# EAGLE design doodle with onboard clock smd 7805 (EAGLE 6.2)
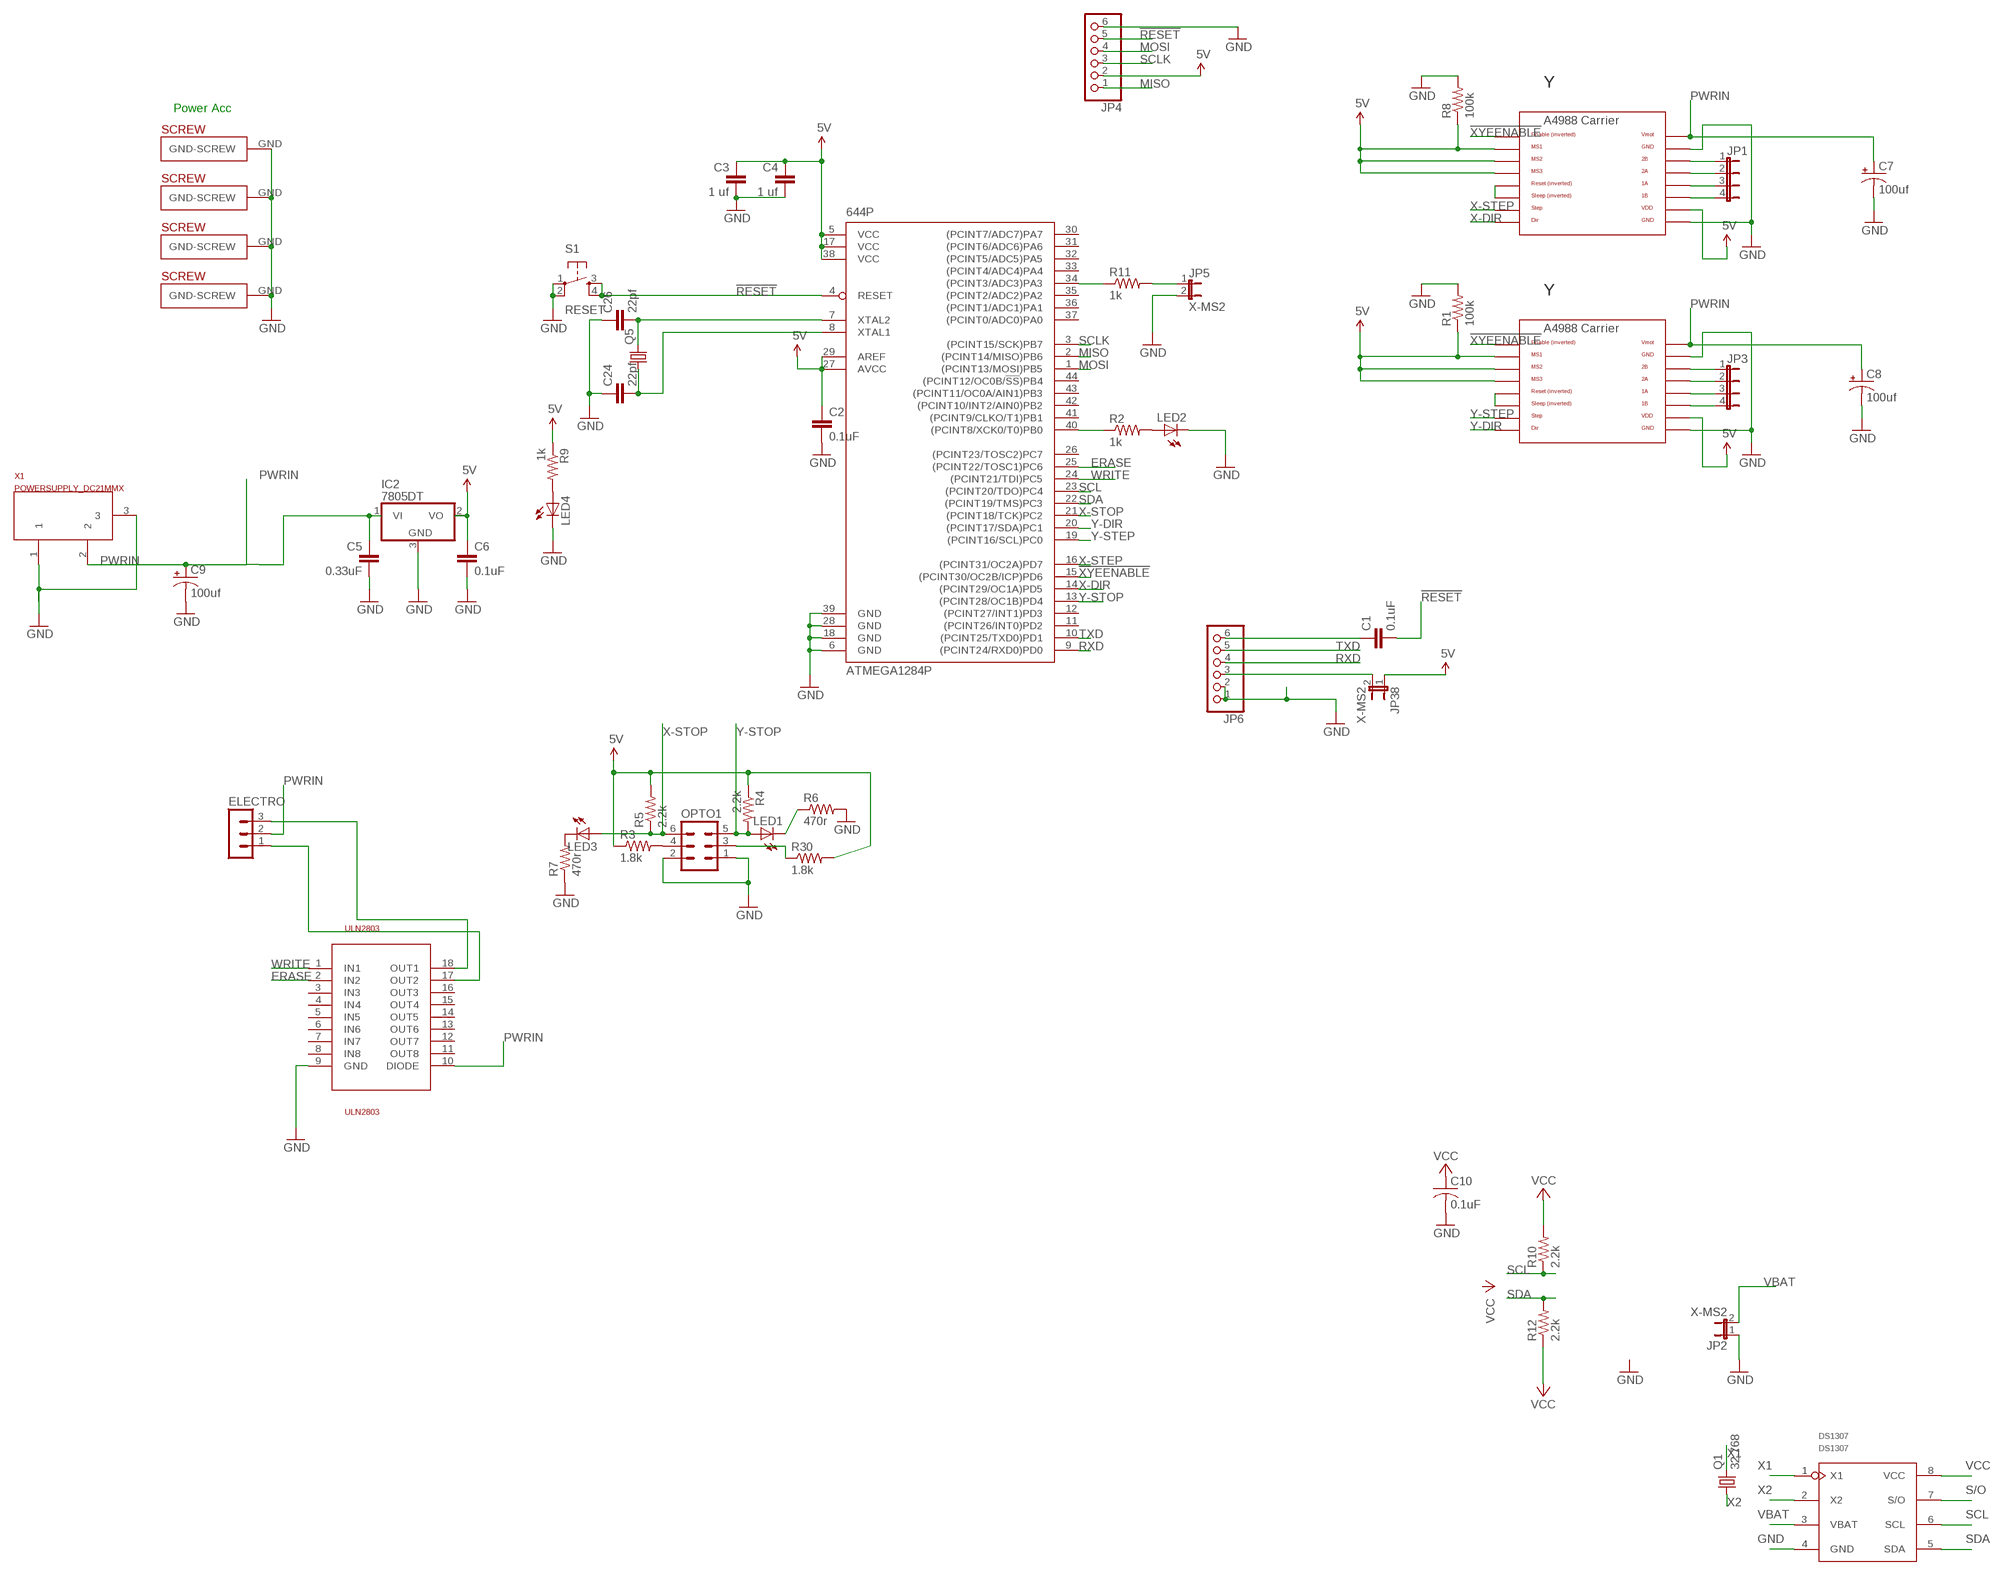
[diagram p0: schematic, sheet 1]

## Parts
644P  ATMEGA1284P  ATMEGA644A  [TQFP44]
C1  0.1uF  CAP0805  [0805]
C2  0.1uF  CAP0805  [0805]
C3  1 uf  CAP0805  [0805]
C4  1 uf  CAP0805  [0805]
C5  0.33uF  CAPPTH2  [CAP-PTH-SMALL2]
C6  0.1uF  CAPPTH2  [CAP-PTH-SMALL2]
C7  100uf  CAP_POLPTH1  [CPOL-RADIAL-100UF-25V]
C8  100uf  CAP_POLPTH1  [CPOL-RADIAL-100UF-25V]
C9  100uf  CAP_POLPTH1  [CPOL-RADIAL-100UF-25V]
C10  0.1uF  C-USC0805  [C0805]
C24  22pf  CAP0805  [0805]
C26  22pf  CAP0805  [0805]
DS1307  DS1307  [SO08]
ELECTRO  MA03-1  [MA03-1]
IC2  7805DT  [TO252]
JP1  JP4E  [JP4]
JP2  X-MS2  JUMPER-2PTH  [1X02]
JP3  JP4E  [JP4]
JP4  PINHD-1X6/90  [1X06/90]
JP5  X-MS2  JUMPER-2PTH  [1X02]
JP6  PINHD-1X6  [1X06]
JP38  X-MS2  JUMPER-2PTH  [1X02]
LED1  LEDCHIPLED_0805  [CHIPLED_0805]
LED2  LEDCHIPLED_0805  [CHIPLED_0805]
LED3  LEDCHIPLED_0805  [CHIPLED_0805]
LED4  LEDCHIPLED_0805  [CHIPLED_0805]
OPTO1  MA03-2  [MA03-2]
Q1  32.768  CRYTALTC38H  [TC38H]
Q5  CRYSTALHC49S  [HC49/S]
R1  100k  R-US_0207/7  [0207/7]
R2  1k  R-US_R0805  [R0805]
R3  1.8k  R-US_R0805  [R0805]
R4  2.2k  R-US_R0805  [R0805]
R5  2.2k  R-US_R0805  [R0805]
R6  470r  R-US_R0805  [R0805]
R7  470r  R-US_R0805  [R0805]
R8  100k  R-US_0207/7  [0207/7]
R9  1k  R-US_R0805  [R0805]
R10  2.2k  R-US_R0805  [R0805]
R11  1k  R-US_R0805  [R0805]
R12  2.2k  R-US_R0805  [R0805]
R30  1.8k  R-US_R0603  [R0603]
S1  RESET  TAC_SWITCHPTH  [TACTILE-PTH]
U$1  A4988BREAKOUT  [A4988BREAKOUT]
U$7  A4988BREAKOUT  [A4988BREAKOUT]
U$14  PLATED-SCREW  [PLATEDSCREW]
U$17  PLATED-SCREW  [PLATEDSCREW]
U$18  PLATED-SCREW  [PLATEDSCREW]
U$38  PLATED-SCREW  [PLATEDSCREW]
ULN2803  ULN2803  [SO18L]
X1  POWERSUPPLY_DC21MMX  [POWERSUPPLY_DC-21MM]

## Nets
5V: 644P.5(VCC) 644P.17(VCC) 644P.27(AVCC) 644P.29(AREF) 644P.38(VCC) C2.1 C3.1 C4.1 C6.1 IC2.2(VO) JP4.2 JP38.1 R1.1 R3.1 R4.1 R5.2 R8.1 R9.1 R30.2 U$1.MS1 U$1.MS2 U$1.MS3 U$1.VDD U$7.MS1 U$7.MS2 U$7.MS3 U$7.VDD
!RESET: 644P.4(RESET) C1.2 JP4.5 S1.3 S1.4
!XYEENABLE: 644P.15((PCINT30/OC2B/ICP)PD6) U$1.EN U$7.EN
ERASE: 644P.25((PCINT22/TOSC1)PC6) ULN2803.2(IN2)
GND: 644P.6(GND) 644P.18(GND) 644P.28(GND) 644P.39(GND) C2.2 C3.2 C4.2 C5.2 C6.2 C7.2(-) C8.2(-) C9.2(-) C10.2 C24.1 C26.1 DS1307.4(GND) IC2.3(GND) JP2.1 JP4.6 JP5.2 JP6.1 JP6.2 LED2.C LED4.C OPTO1.1 OPTO1.2 R1.2 R6.2 R7.1 R8.2 S1.1 S1.2 U$1.GND U$1.GND@0(GND) U$7.GND U$7.GND@0(GND) U$14.GND(GND-SCREW) U$17.GND(GND-SCREW) U$18.GND(GND-SCREW) U$38.GND(GND-SCREW) ULN2803.9(GND) X1.1 X1.3
MISO: 644P.2((PCINT14/MISO)PB6) JP4.1
MOSI: 644P.1((PCINT13/MOSI)PB5) JP4.4
N$1: U$1.RST U$1.SLP(SLEEP)
N$2: JP3.1 U$1.2B
N$3: JP3.2 U$1.2A
N$4: JP3.3 U$1.1A
N$5: JP3.4 U$1.1B
N$6: ELECTRO.1 ULN2803.17(OUT2)
N$7: ELECTRO.3 ULN2803.18(OUT1)
N$8: OPTO1.4 R3.2
N$9: LED2.A R2.2
N$10: 644P.40((PCINT8/XCK0/T0)PB0) R2.1
N$11: LED1.C R6.1
N$12: LED3.C R7.2
N$13: OPTO1.3 R30.1
N$14: JP1.1 U$7.2B
N$15: JP1.2 U$7.2A
N$16: JP1.3 U$7.1A
N$17: JP1.4 U$7.1B
N$18: 644P.34((PCINT3/ADC3)PA3) R11.1
N$19: LED4.A R9.2
N$20: JP5.1 R11.2
N$23: U$7.RST U$7.SLP(SLEEP)
N$70: C1.1 JP6.6
N$71: JP6.3 JP38.2
N$80: 644P.7(XTAL2) C26.2 Q5.2
N$81: 644P.8(XTAL1) C24.2 Q5.1
PWRIN [power]: C5.1 C7.1(+) C8.1(+) C9.1(+) ELECTRO.2 IC2.1(VI) U$1.VMOT U$7.VMOT ULN2803.10(DIODE) X1.2
RXD: 644P.9((PCINT24/RXD0)PD0) JP6.4
S/O: DS1307.7(S/O)
SCL: 644P.23((PCINT20/TDO)PC4) DS1307.6(SCL) R10.1
SCLK: 644P.3((PCINT15/SCK)PB7) JP4.3
SDA: 644P.22((PCINT19/TMS)PC3) DS1307.5(SDA) R12.2
TXD: 644P.10((PCINT25/TXD0)PD1) JP6.5
VBAT: DS1307.3(VBAT) JP2.2
VCC: C10.1 DS1307.8(VCC) R10.2 R12.1
WRITE: 644P.24((PCINT21/TDI)PC5) ULN2803.1(IN1)
X1: DS1307.1(X1) Q1.2
X2: DS1307.2(X2) Q1.1
X-DIR: 644P.14((PCINT29/OC1A)PD5) U$7.DIR
X-STEP: 644P.16((PCINT31/OC2A)PD7) U$7.STEP
X-STOP: 644P.21((PCINT18/TCK)PC2) LED3.A OPTO1.6 R5.1
Y-DIR: 644P.20((PCINT17/SDA)PC1) U$1.DIR
Y-STEP: 644P.19((PCINT16/SCL)PC0) U$1.STEP
Y-STOP: 644P.13((PCINT28/OC1B)PD4) LED1.A OPTO1.5 R4.2
Unconnected: 644P.11((PCINT26/INT0)PD2) 644P.12((PCINT27/INT1)PD3) 644P.26((PCINT23/TOSC2)PC7) 644P.30((PCINT7/ADC7)PA7) 644P.31((PCINT6/ADC6)PA6) 644P.32((PCINT5/ADC5)PA5) 644P.33((PCINT4/ADC4)PA4) 644P.35((PCINT2/ADC2)PA2) 644P.36((PCINT1/ADC1)PA1) 644P.37((PCINT0/ADC0)PA0) 644P.41((PCINT9/CLKO/T1)PB1) 644P.42((PCINT10/INT2/AIN0)PB2) 644P.43((PCINT11/OC0A/AIN1)PB3) 644P.44((PCINT12/OC0B/!SS!)PB4) ULN2803.3(IN3) ULN2803.4(IN4) ULN2803.5(IN5) ULN2803.6(IN6) ULN2803.7(IN7) ULN2803.8(IN8) ULN2803.11(OUT8) ULN2803.12(OUT7) ULN2803.13(OUT6) ULN2803.14(OUT5) ULN2803.15(OUT4) ULN2803.16(OUT3)

## Notes on the sheet
- Y
- Power Acc
- Y

## Library data of the parts
644P = atmel:ATMEGA644: 8-bit Microcontroller with 64K Bytes In-System Programmable Flash Source: http://www.atmel.com/dyn/resources/prod_documents/doc2593.pdf; MPN: ATMEGA644PV-10AU; OC_FARNELL: 1455123; OC_NEWARK: 58M3748
C1-C6 C24 C26 = SparkFun:CAP: Capacitor Standard 0603 ceramic capacitor, and 0.1" leaded capacitor.
C7-C9 = SparkFun:CAP_POL: Capacitor Polarized These are standard SMD and PTH capacitors. Normally 10uF, 47uF, and 100uF in electrolytic and tantalum varieties. Always verify the external diameter of the through hole cap, it varies with capacity, voltage, and manufacturer. The EIA devices should be standard.
C10 = adafruit:C-US: CAPACITOR, American symbol
DS1307 = Seeed:DS1307
ELECTRO = con-lstb:MA03-1: PIN HEADER; OC_FARNELL: unknown; OC_NEWARK: unknown
IC2 = linear:78*: Positive VOLTAGE REGULATOR Source: http://cache.national.com/ds/LM/LM78L05.pdf http://www.fairchildsemi.com/ds/LM/LM7805.pdf
JP1 JP3 = jumper:JP4E: JUMPER
JP2 JP5 JP38 = SparkFun:JUMPER-2: Jumper Basic 0.1" spaced jumper. Use with breakaway headers.
JP4 JP6 = pinhead:PINHD-1X6: PIN HEADER
LED1-LED4 = led:LED: LED OSRAM: - CHIPLED LG R971, LG N971, LY N971, LG Q971, LY Q971, LO R971, LY R971 LH N974, LH R974 LS Q976, LO Q976, LY Q976 LO Q996 - Hyper CHIPLED LW Q18S LB Q993, LB Q99A, LB R99A - SideLED LS A670, LO A670, LY A670, LG A670, LP A670 LB A673, LV A673, LT A673, LW A673 LH A674 LY A675 LS A676, LA A676, LO A676, LY A676, LW A676 LS A679, LY A679, LG A679 - Hyper Micro SIDELED® LS Y876, LA Y876, LO Y876, LY Y876 LT Y87S - SmartLED LW L88C, LW L88S LB L89C, LB L89S, LG L890 LS L89K, LO L89K, LY L89K LS L896, LA L896, LO L896, LY L896 - TOPLED LS T670, LO T670, LY T670, LG T670, LP T670 LSG T670, LSP T670, LSY T670, LOP T670, LYG T670 LG T671, LOG T671, LSG T671 LB T673, LV T673, LT T673, LW T673 LH T674 LS T676, LA T676, LO T676, LY T676, LB T676, LH T676, LSB T676, LW T676 LB T67C, LV T67C, LT T67C, LS T67K, LO T67K, LY T67K, LW E67C LS E67B, LA E67B, LO E67B, LY E67B, LB E67C, LV E67C, LT E67C LW T67C LS T679, LY T679, LG T679 LS T770, LO T770, LY T770, LG T770, LP T770 LB T773, LV T773, LT T773, LW T773 LH T774 LS E675, LA E675, LY E675, LS T675 LS T776, LA T776, LO T776, LY T776, LB T776 LHGB T686 LT T68C, LB T68C - Hyper Mini TOPLED® LB M676 - Mini TOPLED Santana® LG M470 LS M47K, LO M47K, LY M47K Source: http://www.osram.convergy.de LUXEON: - LUMILED® LXK2-PW12-R00, LXK2-PW12-S00, LXK2-PW14-U00, LXK2-PW14-V00 LXK2-PM12-R00, LXK2-PM12-S00, LXK2-PM14-U00 LXK2-PE12-Q00, LXK2-PE12-R00, LXK2-PE12-S00, LXK2-PE14-T00, LXK2-PE14-U00 LXK2-PB12-K00, LXK2-PB12-L00, LXK2-PB12-M00, LXK2-PB14-N00, LXK2-PB14-P00, LXK2-PB14-Q00 LXK2-PR12-L00, LXK2-PR12-M00, LXK2-PR14-Q00, LXK2-PR14-R00 LXK2-PD12-Q00, LXK2-PD12-R00, LXK2-PD12-S00 LXK2-PH12-R00, LXK2-PH12-S00 LXK2-PL12-P00, LXK2-PL12-Q00, LXK2-PL12-R00 Source: www.luxeon.com KINGBRIGHT: KA-3528ASYC Source: www.kingbright.com
OPTO1 = con-lstb:MA03-2: PIN HEADER; OC_FARNELL: unknown; OC_NEWARK: unknown
Q1 = crystal:CRYTAL: CRYSTAL
Q5 = crystal:CRYSTAL: CRYSTAL; OC_FARNELL: 1667008; OC_NEWARK: unknown
R1 R8 = adafruit:R-US_: RESISTOR, American symbol
R2-R7 R9-R12 R30 = resistor:R-US_: RESISTOR, American symbol
S1 = SparkFun:TAC_SWITCH: Momentary Switch Button commonly used for reset or general input. Spark Fun Electronics SKU : COM-00097
U$1 U$7 = RepRapjr:A4988BREAKOUT
U$14 U$17 U$18 U$38 = Sanguinololu:PLATED-SCREW
ULN2803 = uln2803:ULN2803
X1 = SmartPrj:POWERSUPPLY_DC21MM

## Board
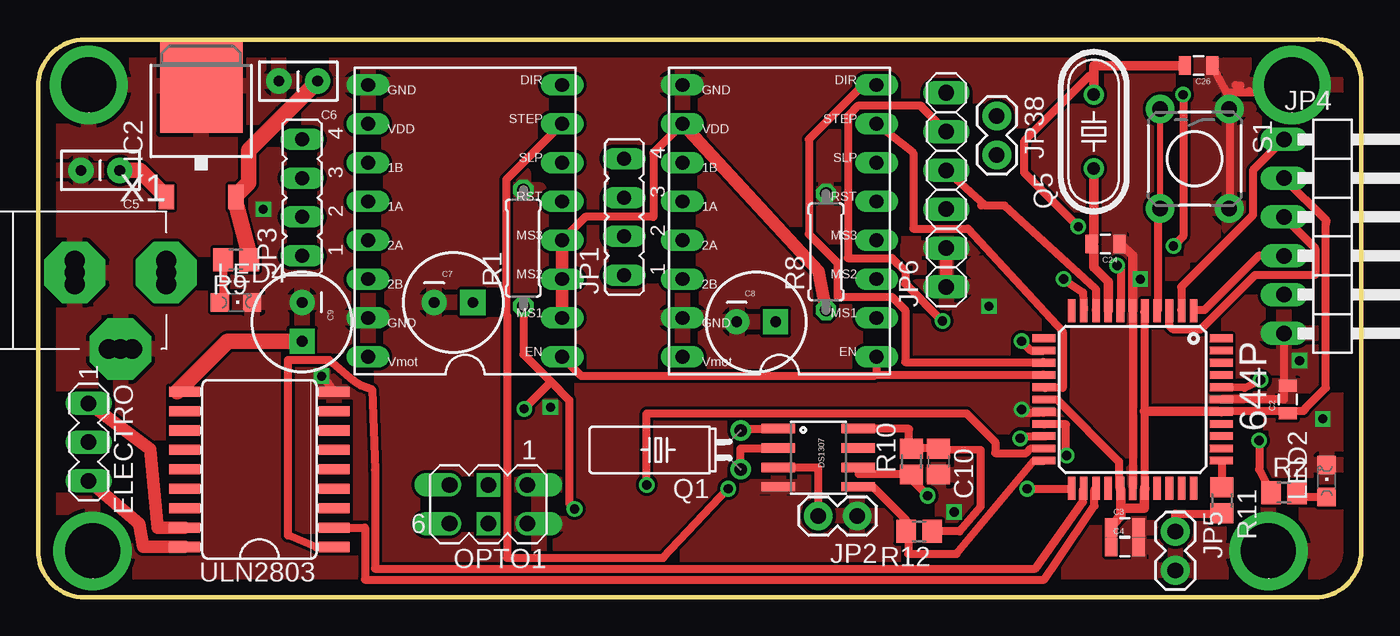
[diagram p1: board, top side]
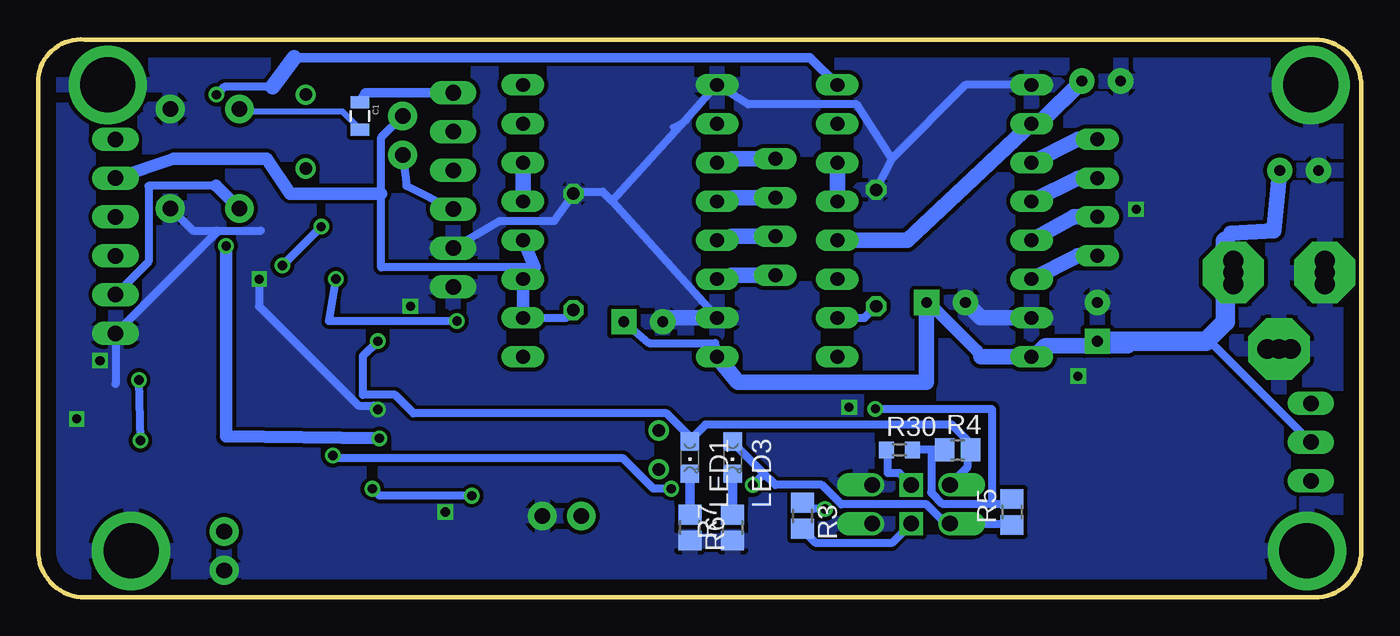
[diagram p2: board, bottom side, seen from below]

Size 86.59 x 36.51 mm. Coordinates in mm from the lower left corner, seen from the top.
Outline: 0,33.45 0,3.05 arc90 3.05,0 83.55,0 arc90 86.59,3.05 86.59,33.96 arc90 83.55,36.5 3.05,36.5 arc90 0,33.45
Copper layers (1*16): Top 0.035mm / dielectric 1.5mm / Bottom 0.035mm
Design rules: minimum track width 20mil, minimum drill 24mil, track to track 8mil, track to pad 8mil, pad to pad 8mil, via to via 8mil, smd to smd 8mil, copper to edge 40mil, drill to drill 8mil, minimum pad ring 10mil, minimum via ring 8mil, stop-mask expansion 4mil, vias tented up to drill 0mil, thermal gap 10mil

### Footprints (pad centres in the part's own frame; a part is rotated, then mirrored left to right if it is on the bottom)
TQFP44 = smd 1.5 x 0.5: 1 -5.8,4; 2 -5.8,3.2; 3 -5.8,2.4; 4 -5.8,1.6; 5 -5.8,0.8; 6 -5.8,0; 7 -5.8,-0.8; 8 -5.8,-1.6; 9 -5.8,-2.4; 10 -5.8,-3.2; 11 -5.8,-4; 23 5.8,-4; 24 5.8,-3.2; 25 5.8,-2.4; 26 5.8,-1.6; 27 5.8,-0.8; 28 5.8,0; 29 5.8,0.8; 30 5.8,1.6; 31 5.8,2.4; 32 5.8,3.2; 33 5.8,4 | smd 0.5 x 1.5: 12 -4,-5.8; 13 -3.2,-5.8; 14 -2.4,-5.8; 15 -1.6,-5.8; 16 -0.8,-5.8; 17 0,-5.8; 18 0.8,-5.8; 19 1.6,-5.8; 20 2.4,-5.8; 21 3.2,-5.8; 22 4,-5.8; 34 4,5.8; 35 3.2,5.8; 36 2.4,5.8; 37 1.6,5.8; 38 0.8,5.8; 39 0,5.8; 40 -0.8,5.8; 41 -1.6,5.8; 42 -2.4,5.8; 43 -3.2,5.8; 44 -4,5.8
0805 = smd 0.8 x 1.2: 1 -0.9,0; 2 0.9,0
CAP-PTH-SMALL2 = drill 0.7 pad 1.651: 1 0,0; 2 2.54,0
CPOL-RADIAL-100UF-25V = drill 0.7 pad 1.651 square: 1 1.27,0 | drill 0.7 pad 1.651: 2 -1.27,0
C0805 = smd 1.3 x 1.5: 1 -0.85,0; 2 0.85,0
SO08 = smd 0.61 x 2.21: 1 -1.905,-2.616; 2 -0.635,-2.616; 3 0.635,-2.616; 4 1.905,-2.616; 5 1.905,2.616; 6 0.635,2.616; 7 -0.635,2.616; 8 -1.905,2.616
MA03-1 = drill 1.016 long: 1 -2.54,0; 2 0,0; 3 2.54,0
TO252 = smd 1 x 1.6: 1 -2.28,-4.8; 2 2.28,-4.8 | smd 5.4 x 6.2: 3 0,2.5
JP4 = drill 0.914 long: 1 -3.81,0; 2 -1.27,0; 3 1.27,0; 4 3.81,0
1X02 = drill 1.016 pad 1.88: 1 0,0; 2 2.54,0
1X06/90 = drill 1.016 long: 1 -6.35,-3.81; 2 -3.81,-3.81; 3 -1.27,-3.81; 4 1.27,-3.81; 5 3.81,-3.81; 6 6.35,-3.81
1X06 = drill 1.016 long: 1 -6.35,0; 2 -3.81,0; 3 -1.27,0; 4 1.27,0; 5 3.81,0; 6 6.35,0
CHIPLED_0805 = smd 1.2 x 1.2: A 0,-1.05; C 0,1.05
MA03-2 = drill 1.016 offset: 1 -2.54,-1.27; 2 -2.54,1.27; 5 2.54,-1.27; 6 2.54,1.27 | drill 1.016 square: 3 0,-1.27; 4 0,1.27
TC38H = drill 0.813: 1 -1.27,0; 2 1.27,0
HC49/S = drill 0.813: 1 -2.413,0; 2 2.413,0
0207/7 = drill 0.813 octagon: 1 -3.81,0; 2 3.81,0
R0805 = smd 1.3 x 1.5: 1 -0.85,0; 2 0.85,0
R0603 = smd 1 x 1.1: 1 -0.85,0; 2 0.85,0
TACTILE-PTH = drill 1.016 pad 1.88: 1 -3.251,2.261; 2 3.251,2.261; 3 -3.251,-2.261; 4 3.251,-2.261
A4988BREAKOUT = drill 0.9 long: 1A 8.89,1.27; 1B 11.43,1.27; 2A 6.35,1.27; 2B 3.81,1.27; DIR 16.51,-11.43; EN -1.27,-11.43; GND 16.51,1.27; GND@0 1.27,1.27; MS1 1.27,-11.43; MS2 3.81,-11.43; MS3 6.35,-11.43; RST 8.89,-11.43; SLP 11.43,-11.43; STEP 13.97,-11.43; VDD 13.97,1.27; VMOT -1.27,1.27
PLATEDSCREW = drill 3.6: GND 0,0
SO18L = smd 0.66 x 2.032: 1 -5.08,-4.902; 2 -3.81,-4.902; 3 -2.54,-4.902; 4 -1.27,-4.902; 5 0,-4.902; 6 1.27,-4.902; 7 2.54,-4.902; 8 3.81,-4.902; 9 5.08,-4.902; 10 5.08,4.902; 11 3.81,4.902; 12 2.54,4.902; 13 1.27,4.902; 14 0,4.902; 15 -1.27,4.902; 16 -2.54,4.902; 17 -3.81,4.902; 18 -5.08,4.902
POWERSUPPLY_DC-21MM = drill 1.3 pad 4 octagon: 1 -5.08,-3.353; 2 -0.076,-6.35; 3 -0.076,-0.356 | drill 1.3: 4 -5.08,-4.115; 5 -5.08,-2.591; 6 -0.838,-0.356; 7 0.686,-0.356; 8 -0.838,-6.35; 9 0.686,-6.35

### Placement (x,y rotation side)
644P  71.63,12.95 270 top
C1  65.53,31.5 270 bottom
C2  81.79,12.95 90 top
C3  71.12,4.57 0 top
C4  71.12,3.3 0 top
C5  5.33,27.94 180 top
C6  18.29,33.78 180 top
C7  27.18,19.3 0 top
C8  46.99,18.03 0 top
C9  17.27,18.03 270 top
C10  58.93,8.89 270 top
C24  69.85,23.11 180 top
C26  75.95,34.8 180 top
DS1307  51.05,9.14 270 top
ELECTRO  3.3,10.16 270 top
IC2  10.67,30.99 0 top
JP1  38.35,24.89 90 top
JP2  53.59,5.33 180 top
JP3  17.27,26.16 90 top
JP4  85.34,23.62 270 top
JP5  74.42,4.32 270 top
JP6  59.44,26.67 90 top
JP38  62.74,31.5 270 top
LED1  43.94,9.14 180 bottom
LED2  84.33,7.62 0 top
LED3  41.15,9.14 180 bottom
LED4  12.95,19.3 270 top
OPTO1  29.46,6.1 180 top
Q1  45.97,9.65 90 top
Q5  69.09,30.48 90 top
R1  31.75,22.86 90 top
R2  81.53,6.86 0 top
R3  36.58,5.33 270 bottom
R4  26.42,9.65 0 bottom
R5  22.86,5.59 90 bottom
R6  43.94,4.57 270 bottom
R7  41.15,4.57 90 bottom
R8  51.56,22.61 90 top
R9  12.95,22.1 180 top
R10  57.15,8.89 90 top
R11  77.47,6.35 270 top
R12  57.66,4.32 180 top
R30  30.23,9.65 0 bottom
S1  75.69,28.7 270 top
U$1  22.86,17.02 90 top
U$7  43.43,17.02 90 top
U$14  3.3,33.53 0 top
U$17  3.56,3.05 0 top
U$18  80.52,3.05 0 top
U$38  82.04,33.53 0 top
ULN2803  14.48,8.38 90 top
X1  2.03,21.34 90 top

### Tracks (layer width: path | path; a pad name or v marks a point on that pad's centre or on a via)
5V  (via drill 0.61)
  Top 0.406: 82.8,12.19 81.03,12.19 C2.1
  Top 0.508: 644P.29 72.39,7.24 72.39,12.19 72.39,18.67 644P.5 | 644P.17 66.67,12.95 70.74,8.89 70.74,7.24 644P.27 | 644P.38 77.47,12.19 82.8,12.19 82.96,12.39 84.28,13.72 84.28,24.43 84.33,24.64 JP4.2 | U$1.MS3 35.81,24.89 40.26,24.89 40.26,29.08 U$7.VDD | v35.1,5.79 34.75,6.15 34.75,12.9 33.55,14.1 | 33.55,14.1 31.75,15.9 R1.1 | 33.55,14.1 v31.8,12.34 | 13,25.6 12.95,26.16 IC2.2 13.06,26.42 | 13.77,22.1 R9.1
  Top 0.61: C4.1 70.23,3.3 70.23,4.57 C3.1 70.36,4.83 70.87,5.33 70.87,5.84 | 70.87,5.84 70.87,6.99 644P.27 | 70.87,5.84 72.39,5.84 72.39,6.99 644P.29 | 72.39,12.19 77.22,12.19 644P.38
  Top 0.813: U$1.MS3 U$1.MS2 U$1.MS1 | U$7.VDD 51.05,21.34 R8.1
  Top 1.016: 13.77,22.1 13.77,22.61 13,25.6 | 13.06,26.42 13.77,27.13 13.77,29.26 C6.1
  Bottom 0.508: R8.1 52.07,18.29 U$7.MS1 | U$7.MS2 54.1,21.59 64.14,21.59 64.14,26.42 64.14,30.1 JP38.1 | R1.1 32.51,18.29 U$1.MS1 | R4.1 28.14,9.65 | 28.14,9.65 R30.2 | 24.18,6.15 27.43,6.15 28.14,6.86 28.14,9.65 | 24.18,6.15 23.11,6.15 22.86,6.4 R5.2 | v35.1,5.79 36.22,5.79 36.58,6.15 R3.1 | 24.18,6.15 24.18,12.34 v31.8,12.34 | 20.93,31.14 21.08,31.14 U$1.VDD
  Bottom 0.813: U$7.MS1 U$7.MS2 | 54.1,21.59 U$7.MS3 | JP4.2 77.72,28.7 71.63,28.7 70.1,26.42 64.14,26.42
  Bottom 1.016: U$1.VDD 29.72,23.37 U$1.MS3 | 20.93,31.14 C6.1
!RESET
  Top 0.406: S1.3 73.46,31.95 73.46,25.7 S1.4
  Top 0.508: 644P.4 73.28,18.8 73.28,25.27 73.41,25.4 S1.4
  Bottom 0.406: C1.2 65.53,30.63 66.7,31.8 73.25,31.8 73.41,31.95 S1.3
  Bottom 0.508: JP4.5 79.38,21.97 79.38,26.92 74.93,26.92 | 73.53,25.53 S1.4
  Bottom 0.813: 73.53,25.53 74.93,26.92
!XYEENABLE
  Top 0.508: 54.86,14.58 65.79,14.58 644P.15 | U$7.EN 54.86,14.58 | U$1.EN 35.56,14.48 54.66,14.48 54.86,14.58
ERASE
  Top 0.508: ULN2803.2 21.39,4.57 21.39,1.17 65.84,1.17 69.14,5.99 69.14,7.06 69.19,7.11 644P.25
GND  (via drill 0.6, 0.61)
  Top 0.254: S1.1 77.6,32.38 77.95,32.38
  Top 0.406: 14.48,25.09 15.02,25.09
  Top 0.508: 644P.6 644P.28 | 65.79,12.06 644P.18 65.53,12.09 64.36,12.09 v64.36,12.29 | 644P.39 81.53,12.95 JP4.6 | 77.85,32.89 C26.1 | 77.85,32.89 77.85,32 S1.1 77.98,31.75 77.98,25.53 S1.2 | 79.25,33.02 83.31,33.02 U$38.GND | 79.25,33.02 77.98,33.02 77.85,32.89 | 79.25,33.15 79.25,33.02 | 78.36,33.53 78.71,33.48 | ULN2803.9 18.87,14.15 v18.54,14.48
  Top 0.61: 644P.6 71.63,22.35 70.87,23.11 C24.1
  Top 0.813: JP6.2 JP6.1
  Bottom 0.406: 45.06,30.79 44.22,31.22
  Bottom 0.508: 81.53,13.97 JP4.6 74.93,23.88 74.93,24 | 74.93,24 76.45,24 77.85,25.4 S1.2 | 74.93,24 72.01,24 | JP6.2 56.39,24.64 52.83,24.64 R8.2 51.18,26.54 49.66,26.54 49.02,25.91 | 49.02,25.91 U$7.GND@0 | 49.02,25.91 44.22,31.22 U$7.GND 40.13,32.26 33.02,32.26 30.73,28.7 | 30.73,28.7 25.91,33.53 U$1.GND | 30.73,28.7 R1.2 | U$14.GND 5.08,33.53 | v64.36,12.29 64.62,12.55 65.63,12.55 72.14,19.05 v72.14,20.83
  Bottom 1.016: C7.2 24.89,18.29 U$1.GND@0 | C8.2 45.21,18.29 U$7.GND@0
  other vias: 82.55,15.49 62.23,19.05 59.94,5.59 33.53,12.45 84.07,11.68 14.73,25.4
  pour Bottom (isolate 0.254): 3.01,37.5 84.96,37.5 arc-90 88.01,34.45 88.01,2.5 88.01,1.8 arc-90 84.96,-1.25 3.01,-1.25 2.31,-1.25 arc-90 -0.74,1.8 -0.74,33.75 -0.74,34.45 arc-90 2.31,37.5
  pour Top: 3.01,37.5 84.96,37.5 arc-90 88.01,34.45 88.01,32.5 88.01,1.8 arc-90 84.96,-1.25 83.01,-1.25 2.31,-1.25 arc-90 -0.74,1.8 -0.74,33.75 -0.74,34.45 arc-90 2.31,37.5
MISO
  Top 0.508: JP4.1 79.5,27.94 79.5,25.02 74.8,20.32 74.8,18.8 644P.2
MOSI
  Top 0.508: JP4.4 79.88,22.35 76.33,18.8 75.69,18.8 644P.1
N$1
  Bottom 1.016: U$1.SLP U$1.RST
N$2
  Bottom 1.016: U$1.2B 18.54,22.35 JP3.1
N$3
  Bottom 1.016: U$1.2A 18.8,24.89 JP3.2
N$4
  Bottom 1.016: U$1.1A 18.54,27.43 JP3.3
N$5
  Bottom 1.016: U$1.1B 18.54,29.97 JP3.4
N$6
  Top 0.813: ULN2803.17 7.82,4.57 7.32,9.7 ELECTRO.1
N$7
  Top 0.813: ULN2803.18 6.86,3.3 6.6,4.83 ELECTRO.3
N$8
  Bottom 0.508: OPTO1.4 30.73,3.56 35.69,3.56 36.58,4.45 R3.2
N$9
  Top 0.508: LED2.A 84.33,6.6 82.4,6.6 R2.2
N$10  (via drill 0.61)
  Top 0.508: v79.91,10.26 79.91,8.38 80.67,6.86 R2.1 | v80.01,14.22 78.94,13.72 644P.40
  Bottom 0.508: v80.01,14.22 v79.91,10.26
N$11
  Bottom 0.61: R6.1 LED1.C
N$12
  Bottom 0.61: R7.2 LED3.C
N$13
  Bottom 0.508: OPTO1.3 30.23,8.13 30.99,8.13 30.99,9.65 R30.1
N$14
  Bottom 1.016: U$7.2B 41.15,21.08 JP1.1
N$15
  Bottom 1.016: U$7.2A 41.15,23.62 JP1.2
N$16
  Bottom 1.016: U$7.1A 41.15,26.16 JP1.3
N$17
  Bottom 1.016: U$7.1B 41.15,28.7 JP1.4
N$18
  Top 0.508: R11.1 77.47,8.94 644P.34
N$19
  Top 0.508: LED4.A 11.94,19.3 12.09,19.46 12.09,22.1 R9.2
N$20
  Top 0.508: JP5.1 74.42,5.49 77.47,5.49 R11.2
N$23
  Bottom 1.016: U$7.SLP U$7.RST
N$70
  Bottom 0.61: JP6.6 65.15,33.02 65.53,32.38 C1.1
N$71
  Bottom 0.508: JP6.3 62.48,26.92 JP38.2
N$80  (via drill 0.61)
  Top 0.508: v70.61,21.72 70.87,21.46 70.87,18.8 644P.7 | v68.07,24.26 64.52,27.81 64.52,29.84 68.83,34.16 69.09,34.16
  Top 0.61: C26.2 69.09,34.8 69.09,34.16 Q5.2
  Bottom 0.508: v68.07,24.26 v70.61,21.72
N$81
  Top 0.61: Q5.1 69.09,23.24 68.96,23.11 C24.2 69.09,22.98 69.09,21.59 70.03,20.65 644P.8
PWRIN
  Top 0.508: 9.09,13.46 ULN2803.10 | 8.38,26.21 IC2.1
  Top 1.016: 9.09,13.46 12.39,16.76 C9.1 | 8.38,26.21 6.66,27.94 C5.1
  Bottom 0.508: U$7.VMOT 42.29,16.64 46.61,16.64 C8.1 | C7.1 28.32,19.3 | 25.15,16.13 24.89,15.75 | 10.03,16.89 ELECTRO.2 | 21.13,16 U$1.VMOT | 15.29,16.46 C9.1
  Bottom 0.813: 8.89,23.29 X1.2 | 28.32,19.3 25.15,16.13
  Bottom 1.016: 24.89,15.75 U$1.VMOT | U$7.VMOT 40.79,14.07 28.45,14.07 C7.1 | 21.13,16 20.68,16.46 15.29,16.46 | C5.1 5.74,23.98 8.53,23.82 8.89,23.29
  Bottom 1.27: C9.1 10.16,16.76 10.03,16.89 8.89,18.03 8.89,23.29
RXD
  Top 0.508: 61.98,25.65 63.25,25.65 69.21,20.19 69.21,18.8 644P.9 | 61.98,25.65 61.72,25.65 | JP6.4 61.98,25.65
SCL  (via drill 0.61)
  Top 0.508: DS1307.6 53.7,8.48 53.7,8.08 57.15,8.08 R10.1 57.25,7.82 57.25,7.62 v58.22,6.66 | v64.72,7.11 67.61,7.11 644P.23
  Bottom 0.508: v64.72,7.11 64.26,6.66 v58.22,6.66
SCLK
  Top 0.508: JP4.3 83.57,22.86 83.57,21.08 79.63,21.08 76.07,17.53 74.3,17.53 74.04,17.78 74.04,18.67 644P.3
SDA
  Top 0.508: DS1307.5 53.7,7.21 54.66,7.21 56.79,5.08 R12.2 56.95,4.88 56.95,2.85 60.1,2.85 65.18,8.94 65.79,8.94 644P.22
TXD  (via drill 0.61)
  Top 0.508: v67.11,20.83 68.38,19.96 644P.10 | v59.18,18.09 56.74,20.52 56.74,21.34 55.88,22.2 52.98,22.2 52.98,31.5 53.65,32.16 57.81,32.16 57.81,32.11 JP6.5
  Bottom 0.508: v67.11,20.83 67.56,18.09 v59.18,18.09
VBAT
  Top 0.508: JP2.2 51.05,8.48 48.46,8.48 DS1307.3
VCC
  Top 0.508: R12.1 60.3,4.32 61.67,5.94 61.67,9.65 59.33,9.7 58.93,9.7 C10.1 58.73,9.75 57.15,9.75 R10.2 57,9.96 57,11.02 53.7,11.02 DS1307.8
WRITE
  Top 0.508: ULN2803.1 18.14,3.3 16.36,4.06 16.36,15.54 19.05,15.54 20.62,14.22 21.13,13.87 21.84,13.61 22.05,8.33 22.05,1.88 65.28,1.88 68.38,6.25 68.38,7.06 68.43,7.11 644P.24
X1
  Top 0.508: Q1.2 45.97,11.02 48.41,11.02 DS1307.1
X2
  Top 0.508: Q1.1 45.97,9.75 48.41,9.75 DS1307.2
X-DIR
  Top 0.508: U$7.DIR 54,33.53 50.44,29.97 50.44,23.77 52.32,21.89 52.32,19.66 55.88,19.66 56.74,18.8 56.74,15.39 65.79,15.39 644P.14
X-STEP
  Top 0.508: U$7.STEP 57.28,29.08 57.28,24.13 60.83,24.13 67.06,17.4 67.06,13.72 65.91,13.72 644P.16
X-STOP  (via drill 0.61)
  Top 0.508: v39.83,7.37 39.83,12.04 60.76,12.04 62.64,10.16 62.64,9.45 64.67,9.45 64.97,9.75 65.79,9.75 644P.21
  Bottom 0.508: 39.09,8.1 38.35,7.37 35.31,7.37 34.04,6.1 28.45,6.1 27.18,4.83 OPTO1.6 22.86,4.83 R5.1 | 39.09,8.1 41.15,10.16 LED3.A | 39.09,8.1 v39.83,7.37
Y-DIR  (via drill 0.61)
  Top 0.508: v64.26,10.41 64.77,10.54 65.91,10.54 644P.20 | v74.3,22.99 74.93,23.62 v74.93,32.89
  Bottom 0.508: v74.93,32.89 74.42,33.4 71.25,33.4
  Bottom 0.61: 69.85,35.31 36.07,35.31 U$1.DIR
  Bottom 0.813: v64.26,10.41 74.3,10.54 v74.3,22.99
  Bottom 1.016: 69.85,35.31 71.25,33.4
Y-STEP  (via drill 0.61)
  Top 0.508: v67.31,9.3 67.26,9.35 67.26,11.33 65.84,11.33 644P.19 | v45.16,7.11 40.89,2.59 30.68,2.59 30.68,18.49 30.63,18.54 30.63,27.33 U$1.STEP
  Bottom 0.508: v67.31,9.3 67.11,9.09 48.31,9.09 46.33,7.11 v45.16,7.11
Y-STOP  (via drill 0.61)
  Top 0.508: v64.36,16.76 64.97,16.15 65.79,16.15 644P.13
  Bottom 0.508: OPTO1.5 25.78,8.51 25.78,9.53 R4.2 25.65,9.65 25.65,10.16 26.8,11.3 42.93,11.3 43.94,10.29 LED1.A 43.99,10.57 45.47,12.04 62.03,12.04 63.25,13.26 65.33,13.26 65.33,15.8 v64.36,16.76